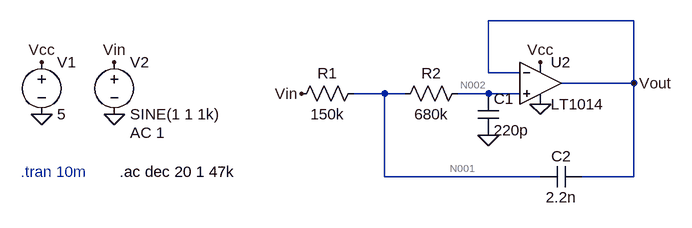
[diagram p0: schematic lowPassFilterSim.asc]
lowPassFilterSim.asc, the LTspice schematic file:
Version 4.1
SHEET 1 888 680
WIRE 768 48 544 48
WIRE 544 128 544 48
WIRE 592 128 544 128
WIRE 768 144 768 48
WIRE 768 144 656 144
WIRE 384 160 336 160
WIRE 416 160 384 160
WIRE 544 160 496 160
WIRE 592 160 544 160
WIRE 384 288 384 160
WIRE 624 288 384 288
WIRE 768 288 768 144
WIRE 768 288 688 288
FLAG -144 192 0
FLAG -144 112 Vcc
FLAG 624 176 0
FLAG 624 112 Vcc
FLAG 544 224 0
FLAG 256 160 Vin
FLAG -32 192 0
FLAG -32 112 Vin
FLAG 768 144 Vout
SYMBOL voltage -144 96 R0
WINDOW 123 0 0 Left 0
WINDOW 39 0 0 Left 0
SYMATTR InstName V1
SYMATTR Value 5
SYMBOL res 352 144 R90
WINDOW 0 0 56 VBottom 2
WINDOW 3 32 56 VTop 2
SYMATTR InstName R1
SYMATTR Value 150k
SYMBOL res 512 144 R90
WINDOW 0 0 56 VBottom 2
WINDOW 3 32 56 VTop 2
SYMATTR InstName R2
SYMATTR Value 680k
SYMBOL cap 528 160 R0
SYMATTR InstName C1
SYMATTR Value 220p
SYMBOL cap 688 272 R90
WINDOW 0 0 32 VBottom 2
WINDOW 3 32 32 VTop 2
SYMATTR InstName C2
SYMATTR Value 2.2n
SYMBOL voltage -32 96 R0
WINDOW 123 24 124 Left 2
WINDOW 39 0 0 Left 0
SYMATTR Value2 AC 1
SYMATTR InstName V2
SYMATTR Value SINE(1 1 1k)
SYMBOL OpAmps\\LT1014 624 80 R0
SYMATTR InstName U2
TEXT -176 280 Left 2 ;.tran 10m
TEXT -24 280 Left 2 !.ac dec 20 1 47k

The netlist it stands for:
* lowPassFilterSim.asc
V1 Vcc 0 5
R1 N001 Vin 150k
R2 N002 N001 680k
C1 N002 0 220p
C2 Vout N001 2.2n
V2 Vin 0 SINE(1 1 1k) AC 1
X§U2 N002 Vout Vcc 0 Vout LT1014  ; pins In+ In- V+ V- OUT
* .tran 10m
.ac dec 20 1 47k
.backanno
.end

* Results of the author's LTspice run, read from the files saved beside the schematic
* Operating Point, zero values left out:
*   V(n001) = 1.002 V
*   V(n002) = 1.01 V
*   V(vcc) = 5 V
*   V(vin) = 1 V
*   V(vout) = 1.01 V
*   I(R1) = 12.15 nA
*   I(R2) = 12.15 nA
*   I(V1) = -350 µA
*   I(V2) = 12.15 nA
*   Ix(u2:1) = -12.15 nA
*   Ix(u2:2) = -12.15 nA
*   Ix(u2:3) = 350 µA
*   Ix(u2:4) = -350 µA
*   Ix(u2:5) = 12.15 nA
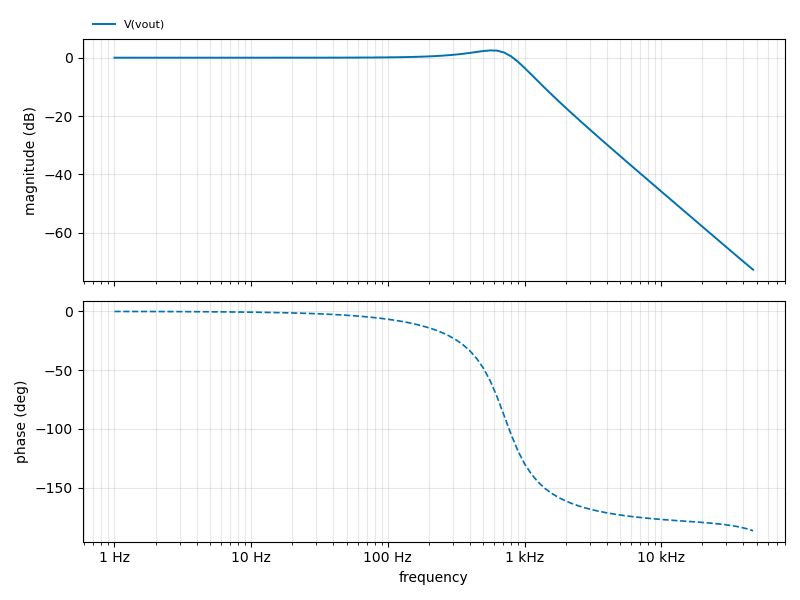
[diagram p1: AC Analysis of lowPassFilterSim.asc, plotted from the saved traces]
* AC Analysis, 1 run:
*   V(vout): -0.00 dB at 1 Hz, -72.59 dB at 47 kHz, peak 2.49 dB at 562.3 Hz, 3 dB below the peak at 848.2 Hz